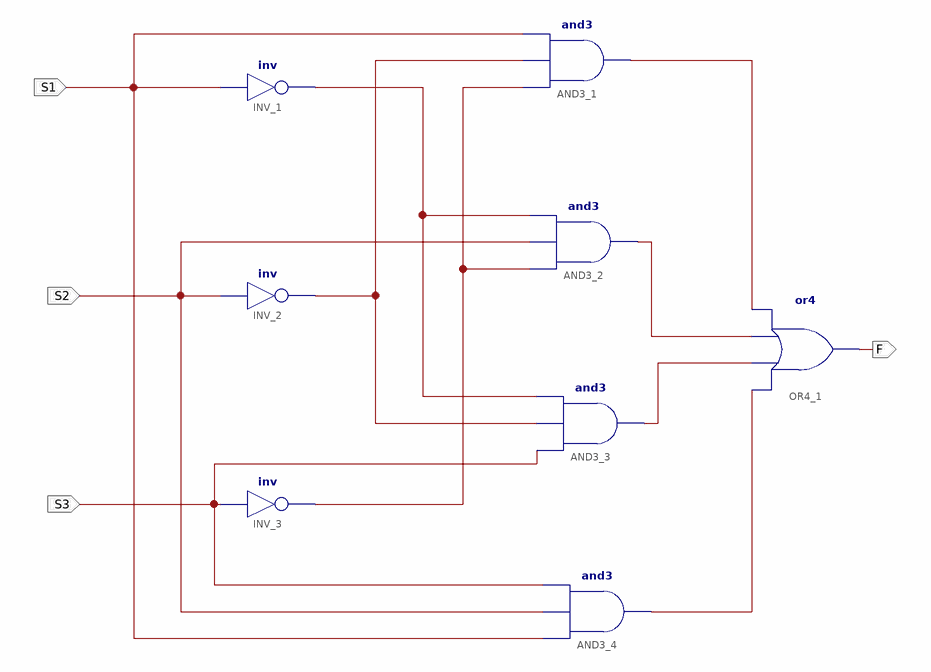
[diagram p0: schematic sheet 1]
// Xilinx ISE schematic Lampcontrol1.sch (kintex7) as structural Verilog: 8 symbols, 4 ports
module Lampcontrol1 (
  input  S3,
  input  S2,
  input  S1,
  output F
);

  wire NS1, NS2, NS3, S1NS2NS3, S1S2S3, S2NS1NS3, S3NS1NS2;

  or OR4_1 (F, S1S2S3, S3NS1NS2, S2NS1NS3, S1NS2NS3);
  not INV_3 (NS3, S3);
  not INV_2 (NS2, S2);
  not INV_1 (NS1, S1);
  and AND3_3 (S3NS1NS2, S3, NS2, NS1);
  and AND3_4 (S1S2S3, S1, S2, S3);
  and AND3_2 (S2NS1NS3, NS3, S2, NS1);
  and AND3_1 (S1NS2NS3, NS3, NS2, S1);
endmodule
